# Altium schematic sheet Main.SchDoc
size A4
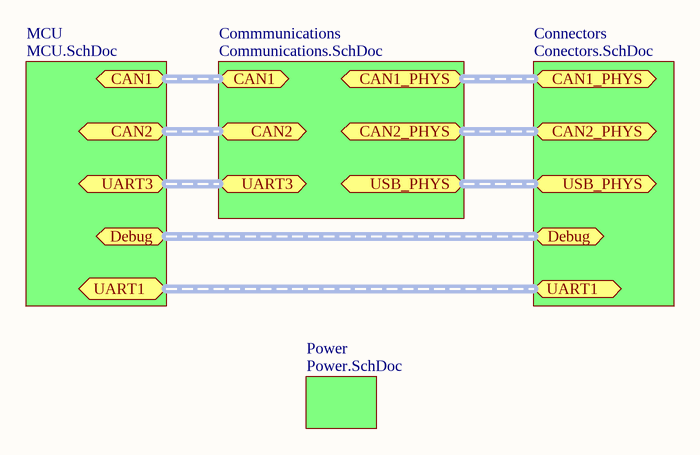
[diagram p0: Main.SchDoc]

## Sub-sheets
Commmunications = Communications.SchDoc: no entries
Connectors = Conectors.SchDoc: no entries
MCU = MCU.SchDoc: no entries
Power = Power.SchDoc: no entries

## Ports
CAN1 (harness CAN), CAN1_PHYS (harness CAN_PHYS), CAN2 (harness CAN), CAN2_PHYS (harness CAN_PHYS), Debug (harness Debug), UART1 (harness UART), UART3 (harness UART with Flow Control), USB_PHYS (harness USB_PHYS)